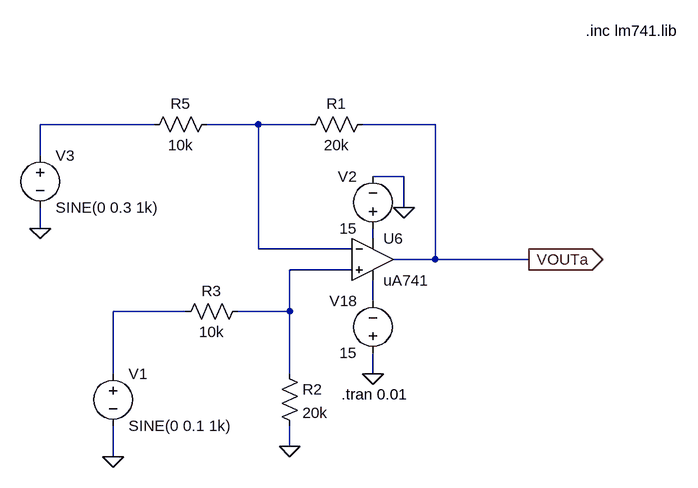
[diagram p0: schematic subtractor circuit.asc]
subtractor circuit.asc, the LTspice schematic file:
Version 4.1
SHEET 1 4784 2492
WIRE 512 1248 336 1248
WIRE 672 1248 592 1248
WIRE 752 1248 672 1248
WIRE 944 1248 832 1248
WIRE 336 1296 336 1248
WIRE 896 1328 848 1328
WIRE 896 1376 896 1328
WIRE 336 1408 336 1376
WIRE 848 1424 848 1408
WIRE 672 1440 672 1248
WIRE 816 1440 672 1440
WIRE 944 1456 944 1248
WIRE 944 1456 880 1456
WIRE 1088 1456 944 1456
WIRE 816 1472 720 1472
WIRE 848 1520 848 1488
WIRE 560 1536 448 1536
WIRE 720 1536 720 1472
WIRE 720 1536 640 1536
WIRE 448 1632 448 1536
WIRE 720 1632 720 1536
WIRE 848 1632 848 1600
WIRE 720 1744 720 1712
WIRE 448 1760 448 1712
FLAG 848 1632 0
FLAG 1088 1456 VOUTa
IOPIN 1088 1456 Out
FLAG 896 1376 0
FLAG 720 1744 0
FLAG 448 1760 0
FLAG 336 1408 0
SYMBOL OpAmps\\opamp2 848 1392 R0
SYMATTR InstName U6
SYMATTR Value uA741
SYMBOL voltage 848 1616 R180
WINDOW 0 24 96 Left 2
WINDOW 3 24 16 Left 2
WINDOW 123 0 0 Left 0
WINDOW 39 0 0 Left 0
SYMATTR InstName V18
SYMATTR Value 15
SYMBOL voltage 848 1424 R180
WINDOW 0 24 96 Left 2
WINDOW 3 24 16 Left 2
WINDOW 123 0 0 Left 0
WINDOW 39 0 0 Left 0
SYMATTR InstName V2
SYMATTR Value 15
SYMBOL res 848 1232 R90
WINDOW 0 0 56 VBottom 2
WINDOW 3 32 56 VTop 2
SYMATTR InstName R1
SYMATTR Value 20k
SYMBOL res 608 1232 R90
WINDOW 0 0 56 VBottom 2
WINDOW 3 32 56 VTop 2
SYMATTR InstName R5
SYMATTR Value 10k
SYMBOL res 704 1616 R0
SYMATTR InstName R2
SYMATTR Value 20k
SYMBOL res 656 1520 R90
WINDOW 0 0 56 VBottom 2
WINDOW 3 32 56 VTop 2
SYMATTR InstName R3
SYMATTR Value 10k
SYMBOL voltage 448 1616 R0
WINDOW 123 0 0 Left 0
WINDOW 39 0 0 Left 0
SYMATTR InstName V1
SYMATTR Value SINE(0 0.1 1k)
SYMBOL voltage 336 1280 R0
WINDOW 123 0 0 Left 0
WINDOW 39 0 0 Left 0
SYMATTR InstName V3
SYMATTR Value SINE(0 0.3 1k)
TEXT 800 1664 Left 2 !.tran 0.01
TEXT 1176 1104 Left 2 !.inc lm741.lib

The netlist it stands for:
* subtractor circuit.asc
X§U6 N004 N002 N003 N005 VOUTa uA741  ; pins In+ In- V+ V- OUT
V18 0 N005 15
V2 N003 0 15
R1 VOUTa N002 20k
R5 N002 N001 10k
R2 N004 0 20k
R3 N004 N006 10k
V1 N006 0 SINE(0 0.1 1k)
V3 N001 0 SINE(0 0.3 1k)
.tran 0.01
.inc lm741.lib
.backanno
.end